# Altium project Oscar_MainBoard.PrjPCB
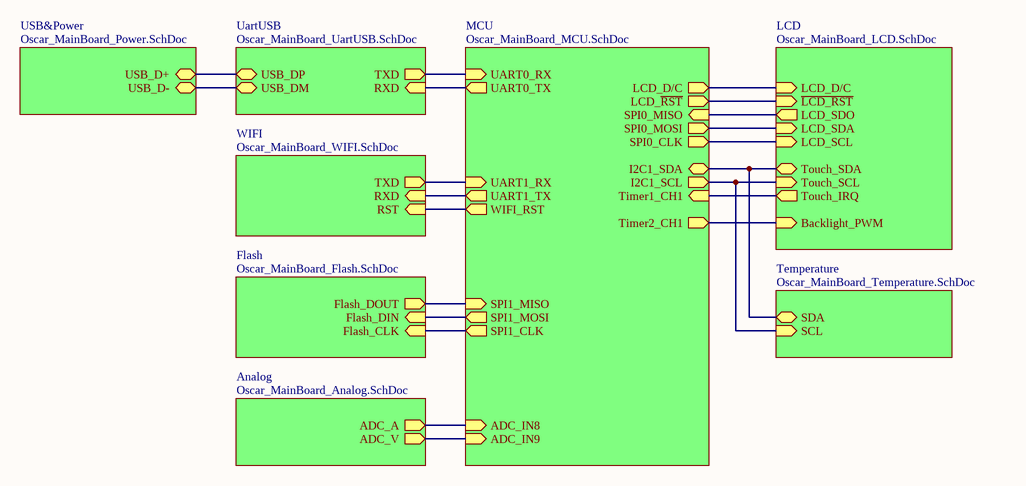
[diagram p0: Oscar_MainBoard_Root.SchDoc]
9 sheets, 103 parts. Net scope: hierarchical (ports join the sheet entries above them; power ports are global).
Board file: Oscar_MainBoard.PcbDoc
Sheets:
  Oscar_MainBoard_Root.SchDoc
    MCU = Oscar_MainBoard_MCU.SchDoc
    LCD = Oscar_MainBoard_LCD.SchDoc
    USB&Power = Oscar_MainBoard_Power.SchDoc
    UartUSB = Oscar_MainBoard_UartUSB.SchDoc
    WIFI = Oscar_MainBoard_WIFI.SchDoc
    Flash = Oscar_MainBoard_Flash.SchDoc
    Temperature = Oscar_MainBoard_Temperature.SchDoc
    Analog = Oscar_MainBoard_Analog.SchDoc

## Sheet Oscar_MainBoard_Root.SchDoc
size A4

### Sub-sheets
Analog = Oscar_MainBoard_Analog.SchDoc: ADC_A (out), ADC_V (out)
Flash = Oscar_MainBoard_Flash.SchDoc: Flash_CLK (in), Flash_DIN (in), Flash_DOUT (out)
LCD = Oscar_MainBoard_LCD.SchDoc: Touch_SCL (in), LCD_SDA (in), LCD_SDO (out), LCD_D/C (in), Backlight_PWM (in), LCD_SCL (in), Touch_SDA (bidir), Touch_IRQ (out), ~{LCD_RST} (in)
MCU = Oscar_MainBoard_MCU.SchDoc: UART1_RX (in), UART1_TX (out), SPI0_MISO (in), SPI0_CLK (out), UART0_RX (in), SPI1_CLK (out), SPI1_MOSI (out), SPI0_MOSI (out), UART0_TX (out), SPI1_MISO (in), I2C1_SDA (bidir), I2C1_SCL (out), LCD_D/C (out), LCD_~{RST} (out), Timer2_CH1 (out), Timer1_CH1 (in), WIFI_RST (out), ADC_IN8 (in), ADC_IN9 (in)
Temperature = Oscar_MainBoard_Temperature.SchDoc: SCL (in), SDA (bidir)
UartUSB = Oscar_MainBoard_UartUSB.SchDoc: USB_DM, USB_DP, RXD (in), TXD (out)
USB&Power = Oscar_MainBoard_Power.SchDoc: USB_D+, USB_D-
WIFI = Oscar_MainBoard_WIFI.SchDoc: TXD (out), RXD (in), RST (in)

### Nets
I2C1_SCL: sheet MCU/I2C1_SCL, sheet LCD/Touch_SCL, sheet Temperature/SCL
I2C1_SDA: sheet MCU/I2C1_SDA, sheet LCD/Touch_SDA, sheet Temperature/SDA
PA2: sheet MCU/UART1_TX, sheet WIFI/RXD
PA3: sheet MCU/UART1_RX, sheet WIFI/TXD
PA4: sheet MCU/LCD_~{RST}, sheet LCD/~{LCD_RST}
PA5: sheet MCU/SPI0_CLK, sheet LCD/LCD_SCL
PA6: sheet MCU/SPI0_MISO, sheet LCD/LCD_SDO
PA7: sheet MCU/SPI0_MOSI, sheet LCD/LCD_SDA
PA9: sheet MCU/UART0_TX, sheet UartUSB/RXD
PA10: sheet MCU/UART0_RX, sheet UartUSB/TXD
PA15: sheet MCU/WIFI_RST, sheet WIFI/RST
PB0: sheet MCU/ADC_IN8, sheet Analog/ADC_A
PB1: sheet MCU/ADC_IN9, sheet Analog/ADC_V
PB2: sheet MCU/LCD_D/C, sheet LCD/LCD_D/C
PB3: sheet MCU/Timer1_CH1, sheet LCD/Touch_IRQ
PB5: sheet MCU/Timer2_CH1, sheet LCD/Backlight_PWM
PB13: sheet MCU/SPI1_CLK, sheet Flash/Flash_CLK
PB14: sheet MCU/SPI1_MISO, sheet Flash/Flash_DOUT
PB15: sheet MCU/SPI1_MOSI, sheet Flash/Flash_DIN
NetU7_4: sheet USB&Power/USB_D+, sheet UartUSB/USB_DP
NetU7_5: sheet USB&Power/USB_D-, sheet UartUSB/USB_DM

## Sheet Oscar_MainBoard_MCU.SchDoc
size A4
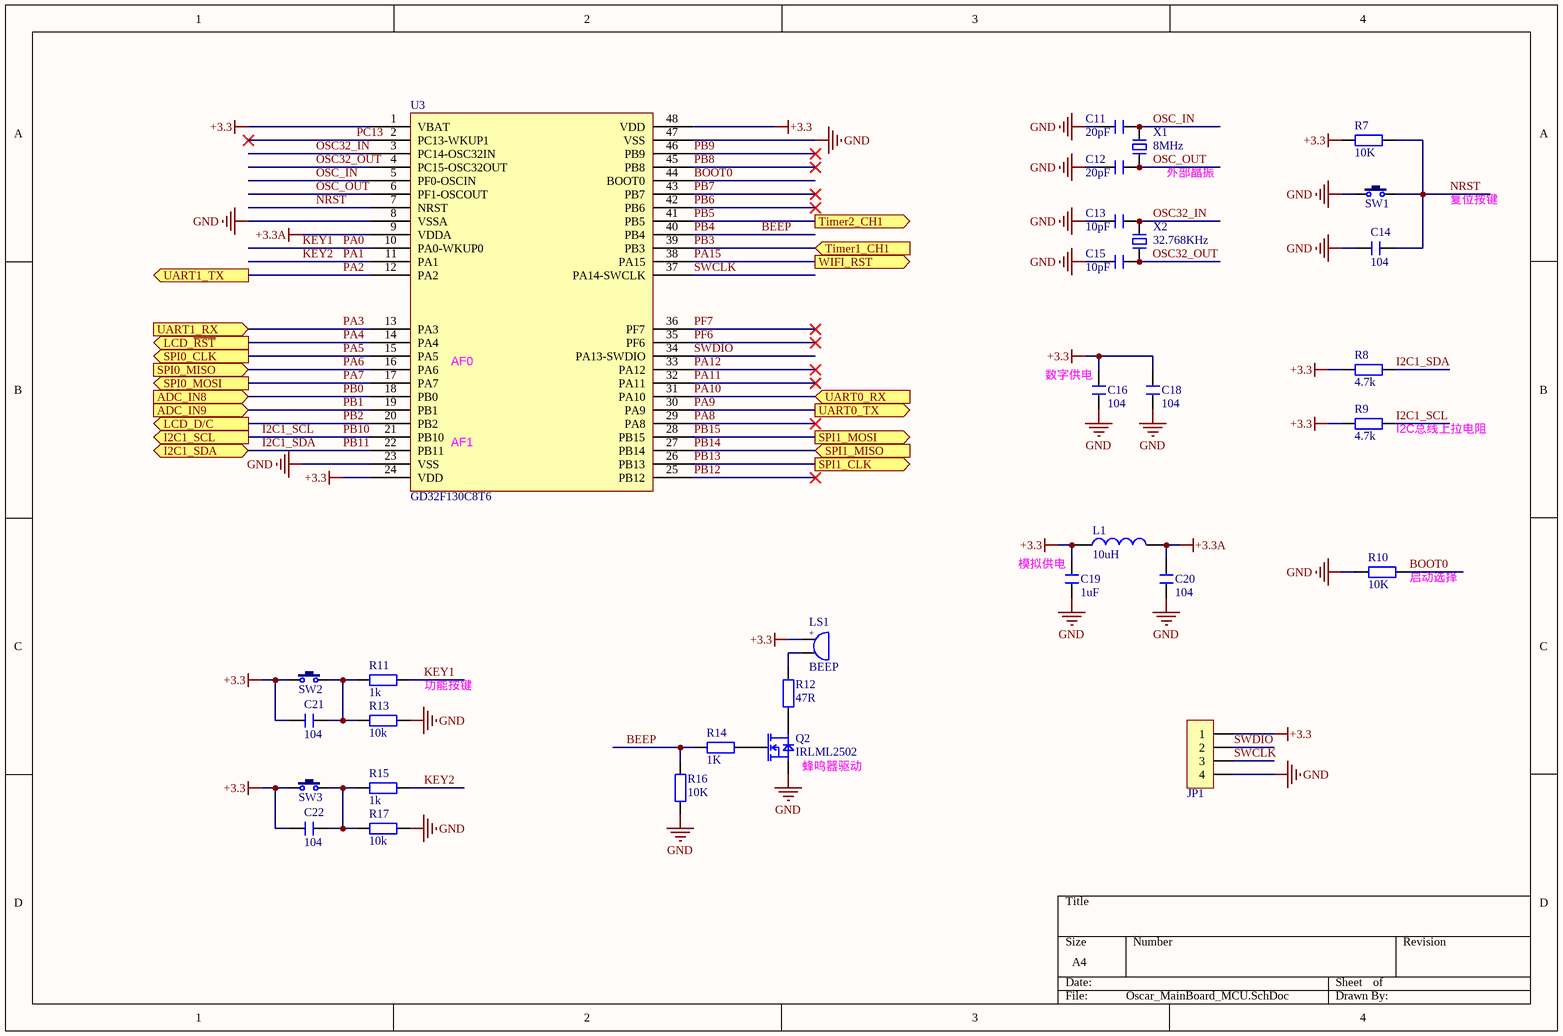
[diagram p1: Oscar_MainBoard_MCU.SchDoc]

### Parts
C11  20pF  [C 0402_L]
C12  20pF  [C 0402_L]
C13  10pF  [C 0402_L]
C14  104  [C 0402_L]
C15  10pF  [C 0402_L]
C16  104  [C 0402_L]
C18  104  [C 0402_L]
C19  1uF  [C 0402_L]
C20  104  [C 0402_L]
C21  104  [C 0402_L]
C22  104  [C 0402_L]
JP1  HDR-1X4  [HDR2.54-WS-4P]  (value not drawn)
L1  10uH  [L 0402]
LS1  BEEP  [BEEP 5020]
Q2  IRLML2502  [SOT23-3n]
R7  10K  [R 0402_L]
R8  4.7k  [R 0402_L]
R9  4.7k  [R 0402_L]
R10  10K  [R 0402_L]
R11  1k  [R 0402_L]
R12  47R  [R 0402_L]
R13  10k  [R 0402_L]
R14  1K  [R 0402_L]
R15  1k  [R 0402_L]
R16  10K  [R 0402_L]
R17  10k  [R 0402_L]
SW1  TSW  [龟仔 3*4]  (value not drawn)
SW2  TSW  [龟仔 3*4]  (value not drawn)
SW3  TSW  [龟仔 3*4]  (value not drawn)
U3  GD32F130C8T6  [LQFP48_N]
X1  8MHz  [NDK 3225]
X2  32.768KHz  [FC-135]

### Ports
ADC_IN8 (in), ADC_IN9 (in), I2C1_SCL (out), I2C1_SDA (bidir), LCD_D/C (out), LCD_~{RST} (out), SPI0_CLK (out), SPI0_MISO (in), SPI0_MOSI (out), SPI1_CLK (out), SPI1_MISO (in), SPI1_MOSI (out), Timer1_CH1 (in), Timer2_CH1 (out), UART0_RX (in), UART0_TX (out), UART1_RX (in), UART1_TX (out), WIFI_RST (out)

### Nets
+3.3: C16.2 C18.2 C19.2 C21.2 C22.2 JP1.1 L1.1 LS1.1 R7.2 R8.2 R9.2 SW2.1 SW3.1 U3.1(VBAT) U3.24(VDD) U3.48(VDD)
+3.3A: C20.2 L1.2 U3.9(VDDA)
GND: C11.1 C12.1 C13.1 C14.1 C15.1 C16.1 C18.1 C19.1 C20.1 JP1.4 Q2.2(S) R10.1 R13.1 R16.1 R17.1 SW1.1 U3.8(VSSA) U3.23(VSS) U3.47(VSS)
BEEP: R14.1 R16.2 U3.40(PB4)  [also labelled PB4]
BOOT0: R10.2 U3.44(BOOT0)
I2C1_SCL: R9.1 U3.21(PB10) ; port I2C1_SCL  [also labelled PB10]
I2C1_SDA: R8.1 U3.22(PB11) ; port I2C1_SDA  [also labelled PB11]
KEY1: R11.1 U3.10(PA0-WKUP0)  [also labelled PA0]
KEY2: R15.1 U3.11(PA1)  [also labelled PA1]
NRST: C14.2 R7.1 SW1.2 U3.7(NRST)
OSC32_IN: C13.2 U3.3(PC14-OSC32IN) X2.2
OSC32_OUT: C15.2 U3.4(PC15-OSC32OUT) X2.1
OSC_IN: C11.2 U3.5(PF0-OSCIN) X1.2
OSC_OUT: C12.2 U3.6(PF1-OSCOUT) X1.1
PA2: U3.12(PA2) ; port UART1_TX
PA3: U3.13(PA3) ; port UART1_RX
PA4: U3.14(PA4) ; port LCD_~{RST}
PA5: U3.15(PA5) ; port SPI0_CLK
PA6: U3.16(PA6) ; port SPI0_MISO
PA7: U3.17(PA7) ; port SPI0_MOSI
PA8: U3.29(PA8)
PA9: U3.30(PA9) ; port UART0_TX
PA10: U3.31(PA10) ; port UART0_RX
PA11: U3.32(PA11)
PA12: U3.33(PA12)
PA15: U3.38(PA15) ; port WIFI_RST
PB0: U3.18(PB0) ; port ADC_IN8
PB1: U3.19(PB1) ; port ADC_IN9
PB2: U3.20(PB2) ; port LCD_D/C
PB3: U3.39(PB3) ; port Timer1_CH1
PB5: U3.41(PB5) ; port Timer2_CH1
PB6: U3.42(PB6)
PB7: U3.43(PB7)
PB8: U3.45(PB8)
PB9: U3.46(PB9)
PB12: U3.25(PB12)
PB13: U3.26(PB13) ; port SPI1_CLK
PB14: U3.27(PB14) ; port SPI1_MISO
PB15: U3.28(PB15) ; port SPI1_MOSI
PC13: U3.2(PC13-WKUP1)
PF6: U3.35(PF6)
PF7: U3.36(PF7)
SWCLK: JP1.3 U3.37(PA14-SWCLK)
SWDIO: JP1.2 U3.34(PA13-SWDIO)
NetC21_1: C21.1 R11.2 R13.2 SW2.2
NetC22_1: C22.1 R15.2 R17.2 SW3.2
NetLS1_2: LS1.2 R12.2
NetQ2_1: Q2.1(G) R14.2
NetQ2_3: Q2.3(D) R12.1

### Notes on the sheet
- 外部晶振
- 复位按键
- (near U3) AF0
- (near C16) 数字供电
- (near U3) AF1
- (near R9) I2C总线上拉电阻
- (near C19) 模拟供电
- (near R10) 启动选择
- 功能按键
- (near Q2) 蜂鸣器驱动
- (in symbol BEEP) +

### Library data of the parts
C11-C16 C18-C22 = C: 贴片电容; BOM名称: 无极性贴片电容; 优秀评价可免费更新: 联系淘宝ID：黄晶宝石，获取更新版封装库; 卖家免费技术支持，联系售后: 唯一出售店铺网址https://shop463601444.taobao.com; 本封装库来自淘宝卖家 ID：黄晶宝石: 其他店铺购入均为盗版，请立即申请退款
JP1 = Header 4: 4P接插件; 版权归属: 封装库来自淘宝 ID：黄晶宝石; 优秀评价可免费更新: 联系淘宝ID：黄晶宝石，获取更新版封装库; 卖家免费技术支持，联系售后: 唯一出售店铺网址https://shop463601444.taobao.com; BOM名称: 4P接插件
L1 = L: 小功率贴片电感; 优秀评价可免费更新: 联系淘宝ID：黄晶宝石，获取更新版封装库; 卖家免费技术支持，联系售后: 唯一出售店铺网址https://shop463601444.taobao.com; 本封装库来自淘宝卖家 ID：黄晶宝石: 其他店铺购入均为盗版，请立即申请退款; BOM名称: 小功率贴片电感
LS1 = BEEP: 蜂鸣器; 优秀评价可免费更新: 联系淘宝ID：黄晶宝石，获取更新版封装库; 卖家免费技术支持，联系售后: 唯一出售店铺网址https://shop463601444.taobao.com; 封装库来自淘宝卖家 ID：黄晶宝石: 其他店铺购入均为盗版，请立即申请退款，本店提供现金奖励; BOM名称: 蜂鸣器
Q2 = IRLML2502: MOSFET N沟道 20V/4.2A
R7-R17 = R: 贴片电阻; 优秀评价可免费更新: 联系淘宝ID：黄晶宝石，获取更新版封装库; 卖家免费技术支持，联系售后: 唯一出售店铺网址https://shop463601444.taobao.com; 本封装库来自淘宝卖家 ID：黄晶宝石: 其他店铺购入均为盗版，请立即申请退款; BOM名称: 贴片电阻
SW1-SW3 = TSW: 轻触开关; BOM名称: 3x6轻触开关; 版权归属: 封装库来自淘宝 ID：黄晶宝石; 优秀评价可免费更新: 联系淘宝ID：黄晶宝石，获取更新版封装库; 卖家免费技术支持，联系售后: 唯一出售店铺网址https://shop463601444.taobao.com; 本封装库来自淘宝卖家 ID：黄晶宝石: 其他店铺购入均为盗版，请立即申请退款
U3 = GD32F130C8T6: 64K 8K 48MHz
X1 X2 = XTAL-2P: 2脚无源脚晶振; 版权归属: 封装库来自淘宝卖家 ID：黄晶宝石; 优秀评价可免费更新: 联系淘宝ID：黄晶宝石，获取更新版封装库; 卖家免费技术支持，联系售后: 唯一出售店铺网址https://shop463601444.taobao.com; 封装库来自淘宝卖家 ID：黄晶宝石: 其他店铺购入均为盗版，请立即申请退款; BOM名称: 2脚无源脚晶振

## Sheet Oscar_MainBoard_LCD.SchDoc
size A4
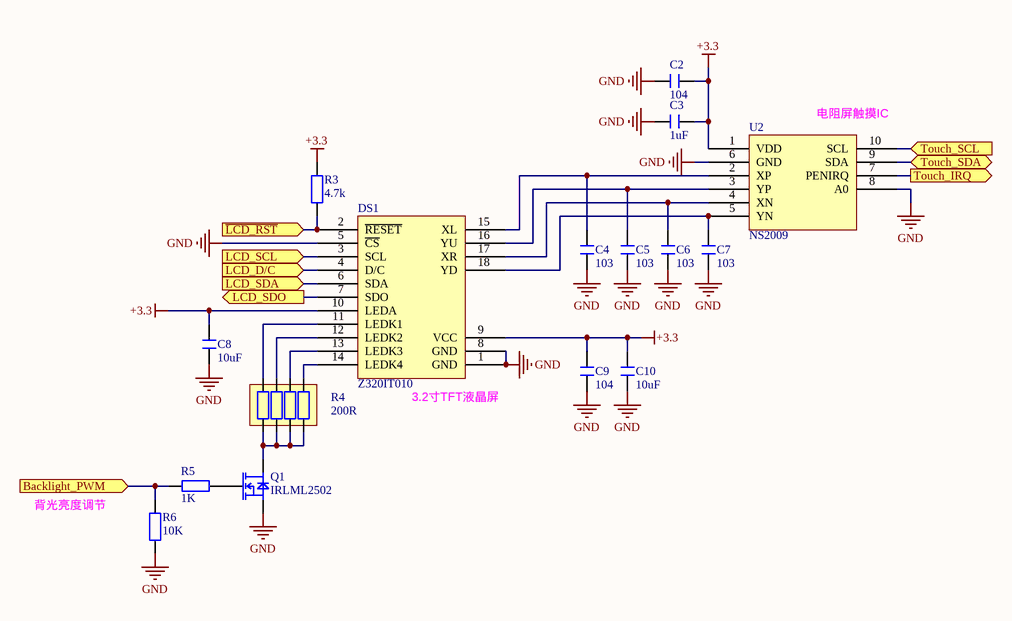
[diagram p2: Oscar_MainBoard_LCD.SchDoc]

### Parts
C2  104  [C 0402_L]
C3  1uF  [C 0402_L]
C4  103  [C 0402_L]
C5  103  [C 0402_L]
C6  103  [C 0402_L]
C7  103  [C 0402_L]
C8  10uF  [C 0603_L]
C9  104  [C 0402_L]
C10  10uF  [C 0603_L]
DS1  Z320IT010  [Z320IT010]
Q1  IRLML2502  [SOT23-3n]
R3  4.7k  [R 0402_L]
R4  200R  [RCA-8P4R-0402]
R5  1K  [R 0402_L]
R6  10K  [R 0402_L]
U2  NS2009  [MSOP10_N]

### Ports
Backlight_PWM (in), LCD_D/C (in), LCD_SCL (in), LCD_SDA (in), LCD_SDO (out), Touch_IRQ (out), Touch_SCL (in), Touch_SDA (bidir), ~{LCD_RST} (in)

### Nets
+3.3: C2.1 C3.1 C8.1 C9.1 C10.1 DS1.9(VCC) DS1.10(LEDA) R3.2 U2.1(VDD)
GND: C2.2 C3.2 C4.2 C5.2 C6.2 C7.2 C8.2 C9.2 C10.2 DS1.1(GND) DS1.5(~{CS}) DS1.8(GND) Q1.2(S) R6.1 U2.6(GND) U2.8(A0)
I2C1_SCL: U2.10(SCL) ; port Touch_SCL
I2C1_SDA: U2.9(SDA) ; port Touch_SDA
PA4: DS1.2(~{RESET}) R3.1 ; port ~{LCD_RST}
PA5: DS1.3(SCL) ; port LCD_SCL
PA6: DS1.7(SDO) ; port LCD_SDO
PA7: DS1.6(SDA) ; port LCD_SDA
PB2: DS1.4(D/C) ; port LCD_D/C
PB3: U2.7(PENIRQ) ; port Touch_IRQ
PB5: R5.1 R6.2 ; port Backlight_PWM
NetC4_1: C4.1 DS1.15(XL) U2.2(XP)
NetC5_1: C5.1 DS1.16(YU) U2.3(YP)
NetC6_1: C6.1 DS1.17(XR) U2.4(XN)
NetC7_1: C7.1 DS1.18(YD) U2.5(YN)
NetDS1_11: DS1.11(LEDK1) R4.8
NetDS1_12: DS1.12(LEDK2) R4.7
NetDS1_13: DS1.13(LEDK3) R4.6
NetDS1_14: DS1.14(LEDK4) R4.5
NetQ1_1: Q1.1(G) R5.2
NetQ1_3: Q1.3(D) R4.1 R4.2 R4.3 R4.4

### Notes on the sheet
- (near U2) 电阻屏触摸IC
- (near DS1) 3.2寸TFT液晶屏
- 背光亮度调节

### Library data of the parts
C2-C10 = C: as C11 on sheet Oscar_MainBoard_MCU
DS1 = Z320IT010: 3.2 inch TFT_LCD SPI
Q1 = IRLML2502: MOSFET N沟道 20V/4.2A
R3 R5 R6 = R: as R7 on sheet Oscar_MainBoard_MCU; BOM名称: 贴片电阻
R4 = R-8P4R: 贴片排阻; BOM名称: 贴片网络排阻; 优秀评价可免费更新: 联系淘宝ID：黄晶宝石，获取更新版封装库; 卖家免费技术支持，联系售后: 唯一出售店铺网址https://shop463601444.taobao.com; 本封装库来自淘宝卖家 ID：黄晶宝石: 其他店铺购入均为盗版，请立即申请退款
U2 = NS2009: I2C接口的4线制电阻式触摸屏控制电路

## Sheet Oscar_MainBoard_Power.SchDoc
size A4
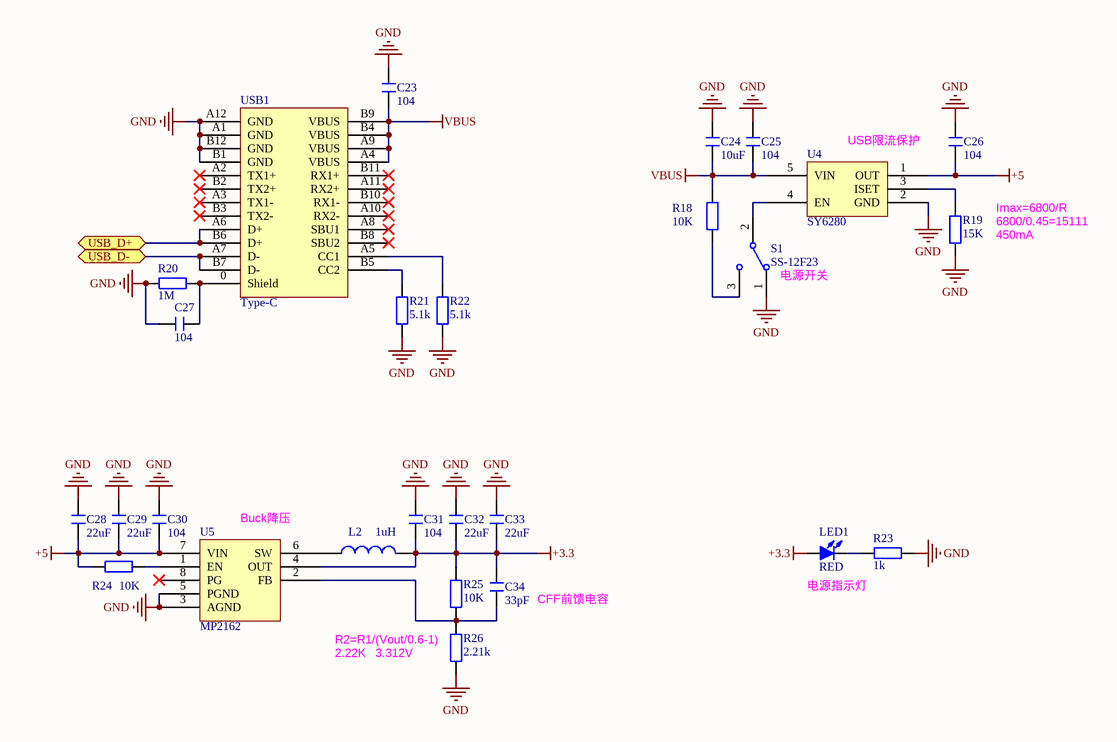
[diagram p3: Oscar_MainBoard_Power.SchDoc]

### Parts
C23  104  [C 0402_L]
C24  10uF  [C 0603_L]
C25  104  [C 0402_L]
C26  104  [C 0402_L]
C27  104  [C 0402_L]
C28  22uF  [C 0805_L]
C29  22uF  [C 0805_L]
C30  104  [C 0402_L]
C31  104  [C 0402_L]
C32  22uF  [C 0805_L]
C33  22uF  [C 0805_L]
C34  33pF  [C 0402_L]
L2  1uH  [CD32]
LED1  RED  [LED_0603]
R18  10K  [R 0402_L]
R19  15K  [R 0402_L]
R20  1M  [R 0402_L]
R21  5.1k  [R 0402_L]
R22  5.1k  [R 0402_L]
R23  1k  [R 0402_L]
R24  10K  [R 0402_L]
R25  10K  [R 0402_L]
R26  2.21k  [R 0402_L]
S1  SS-12F23  [MSK-12C01-07]
U4  SY6280  [SOT23-5N]
U5  MP2162  [QFN8]
USB1  Type-C  [USB-TYPE-C_16PIN-MALE-TYPE-C-31-M-12]

### Ports
USB_D+, USB_D-

### Nets
+3.3: C31.1 C32.1 C33.1 C34.2 L2.2 LED1.1(A) R25.1 U5.4(OUT)
+5: C26.1 C28.1 C29.1 C30.1 R24.1 U4.1(OUT) U5.7(VIN)
GND: C23.2 C24.2 C25.2 C26.2 C27.2 C28.2 C29.2 C30.2 C31.2 C32.2 C33.2 R19.2 R20.2 R21.1 R22.1 R23.2 R26.2 S1.1 U4.2(GND) U5.3(AGND) U5.5(PGND) USB1.A1(GND) USB1.A12(GND) USB1.B1(GND) USB1.B12(GND)
VBUS: C23.1 C24.1 C25.1 R18.1 U4.5(VIN) USB1.A4(VBUS) USB1.A9(VBUS) USB1.B4(VBUS) USB1.B9(VBUS)
NetC27_1: C27.1 R20.1 USB1.0(Shield)
NetC34_1: C34.1 R25.2 R26.1 U5.2(FB)
NetL2_1: L2.1 U5.6(SW)
NetLED1_2: LED1.2(K) R23.1
NetR18_2: R18.2 S1.3
NetR19_1: R19.1 U4.3(ISET)
NetR21_2: R21.2 USB1.B5(CC2)
NetR22_2: R22.2 USB1.A5(CC1)
NetR24_2: R24.2 U5.1(EN)
NetS1_2: S1.2 U4.4(EN)
NetU7_4: USB1.A6(D+) USB1.B6(D+) ; port USB_D+
NetU7_5: USB1.A7(D-) USB1.B7(D-) ; port USB_D-

Not connected (* = marked no-connect by the designer): U5 8(PG)*; USB1 A2(TX1+)* A3(TX1-)* A8(SBU1)* A10(RX2-)* A11(RX2+)* B2(TX2+)* B3(TX2-)* B8(SBU2)* B10(RX1-)* B11(RX1+)*

### Notes on the sheet
- (near U4) USB限流保护
- (near R19) Imax=6800/R
- (near R19) 6800/0.45=15111
- (near R19) 450mA
- (near S1) 电源开关
- (near U5) Buck降压
- (near R26) R2=R1/(Vout/0.6-1)
- (near C34) CFF前馈电容
- (near LED1) 电源指示灯
- 2.22K
- 3.312V

### Library data of the parts
C23-C34 = C: as C11 on sheet Oscar_MainBoard_MCU
L2 = L: as L1 on sheet Oscar_MainBoard_MCU; BOM名称: 小功率贴片电感
LED1 = LED-SMD: 贴片LED; 优秀评价可免费更新: 联系淘宝ID：黄晶宝石，获取更新版封装库; 卖家免费技术支持，联系售后: 唯一出售店铺网址https://shop463601444.taobao.com; 封装库来自淘宝卖家 ID：黄晶宝石: 其他店铺购入均为假冒，请立即申请退款，本店奖励2~5元现金; BOM名称: 贴片LED
R18-R26 = R: as R7 on sheet Oscar_MainBoard_MCU; BOM名称: 贴片电阻
S1 = SSW-1P: 1路波动开关; BOM名称: 波动开关; 版权归属: 封装库来自淘宝 ID：黄晶宝石; 优秀评价可免费更新: 联系淘宝ID：黄晶宝石，获取更新版封装库; 卖家免费技术支持，联系售后: 唯一出售店铺网址https://shop463601444.taobao.com; 本封装库来自淘宝卖家 ID：黄晶宝石: 其他店铺购入均为盗版，请立即申请退款
U4 = SY6280: 电源限流保护芯片
U5 = MP2162: 2.5-6v 2A buck IC

## Sheet Oscar_MainBoard_UartUSB.SchDoc
size A4
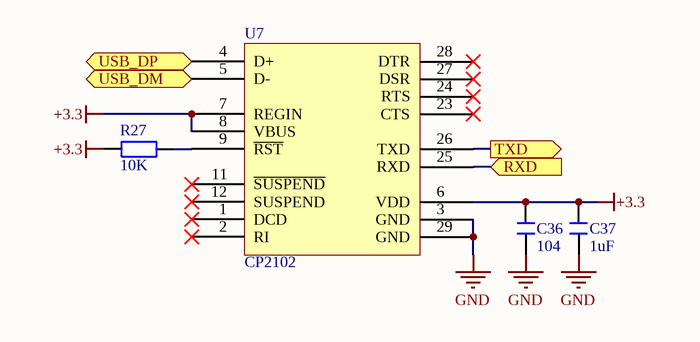
[diagram p4: Oscar_MainBoard_UartUSB.SchDoc]

### Parts
C36  104  [C 0402_L]
C37  1uF  [C 0402_L]
R27  10K  [R 0402_L]
U7  CP2102  [QFN28 5x5_N]

### Ports
RXD (in), TXD (out), USB_DM, USB_DP

### Nets
+3.3: C36.2 C37.2 R27.1 U7.6(VDD) U7.7(REGIN) U7.8(VBUS)
GND: C36.1 C37.1 U7.3(GND) U7.29(GND)
PA9: U7.25(RXD) ; port RXD
PA10: U7.26(TXD) ; port TXD
NetR27_2: R27.2 U7.9(~{RST})
NetU7_4: U7.4(D+) ; port USB_DP
NetU7_5: U7.5(D-) ; port USB_DM

Not connected (* = marked no-connect by the designer): U7 1(DCD)* 2(RI)* 11(~{SUSPEND})* 12(SUSPEND)* 23(CTS)* 24(RTS)* 27(DSR)* 28(DTR)*

### Library data of the parts
C36 C37 = C: as C11 on sheet Oscar_MainBoard_MCU
R27 = R: as R7 on sheet Oscar_MainBoard_MCU; BOM名称: 贴片电阻
U7 = CP2102: CP2102 uart usb

## Sheet Oscar_MainBoard_WIFI.SchDoc
size A4
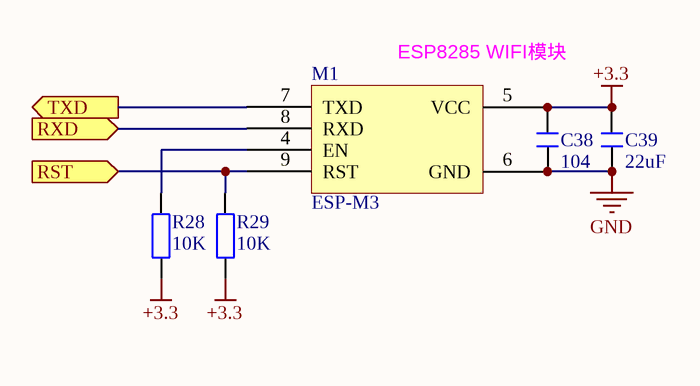
[diagram p5: Oscar_MainBoard_WIFI.SchDoc]

### Parts
C38  104  [C 0402_L]
C39  22uF  [C 0805_L]
M1  ESP-M3  [ESP-M3]
R28  10K  [R 0402_L]
R29  10K  [R 0402_L]

### Ports
RST (in), RXD (in), TXD (out)

### Nets
+3.3: C38.2 C39.2 M1.5(VCC) R28.1 R29.1
GND: C38.1 C39.1 M1.6(GND)
PA2: M1.8(RXD) ; port RXD
PA3: M1.7(TXD) ; port TXD
PA15: M1.9(RST) R29.2 ; port RST
NetM1_4: M1.4(EN) R28.2

### Notes on the sheet
- ESP8285 WIFI模块

### Library data of the parts
C38 C39 = C: as C11 on sheet Oscar_MainBoard_MCU
M1 = ESP-M3: 四博智联ESP-M3无线模块
R28 R29 = R: as R7 on sheet Oscar_MainBoard_MCU; BOM名称: 贴片电阻

## Sheet Oscar_MainBoard_Flash.SchDoc
size A4
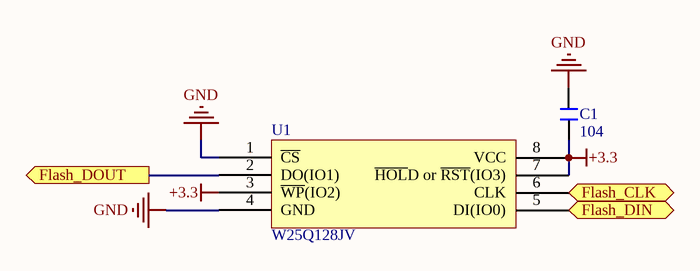
[diagram p6: Oscar_MainBoard_Flash.SchDoc]

### Parts
C1  104  [C 0402_L]
U1  W25Q128JV  [WSON-8_5X6MM]

### Ports
Flash_CLK (in), Flash_DIN (in), Flash_DOUT (out)

### Nets
+3.3: C1.1 U1.3(~{WP}(IO2)) U1.7(~{HOL}D_or_~{RST}(IO3)) U1.8(VCC)
GND: C1.2 U1.1(~{CS}) U1.4(GND)
PB13: U1.6(CLK) ; port Flash_CLK
PB14: U1.2(DO(IO1)) ; port Flash_DOUT
PB15: U1.5(DI(IO0)) ; port Flash_DIN

### Library data of the parts
C1 = C: as C11 on sheet Oscar_MainBoard_MCU
U1 = W25Q128JV: 128Mbit

## Sheet Oscar_MainBoard_Temperature.SchDoc
size A4
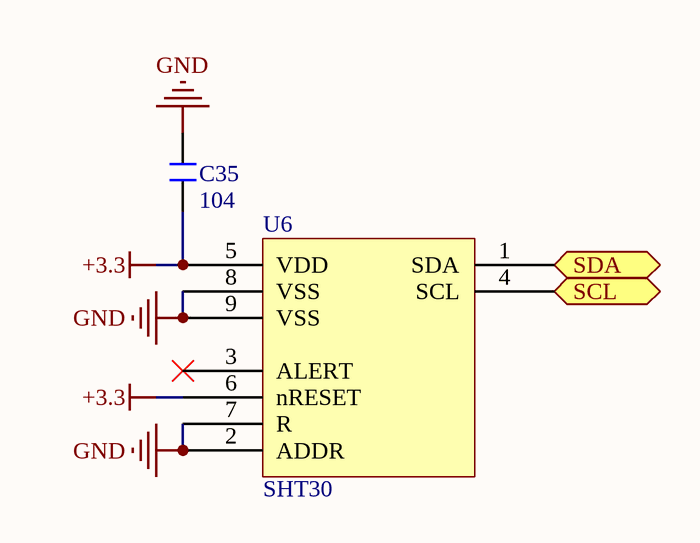
[diagram p7: Oscar_MainBoard_Temperature.SchDoc]

### Parts
C35  104  [C 0402_L]
U6  SHT30  [DFN-8_L2.5-W2.5-P0.50-BL-EP]

### Ports
SCL (in), SDA (bidir)

### Nets
+3.3: C35.1 U6.5(VDD) U6.6(nRESET)
GND: C35.2 U6.2(ADDR) U6.7(R) U6.8(VSS) U6.9(VSS)
I2C1_SCL: U6.4(SCL) ; port SCL
I2C1_SDA: U6.1(SDA) ; port SDA

Not connected (* = marked no-connect by the designer): U6 3(ALERT)*

### Library data of the parts
C35 = C: as C11 on sheet Oscar_MainBoard_MCU

## Sheet Oscar_MainBoard_Analog.SchDoc
size A4
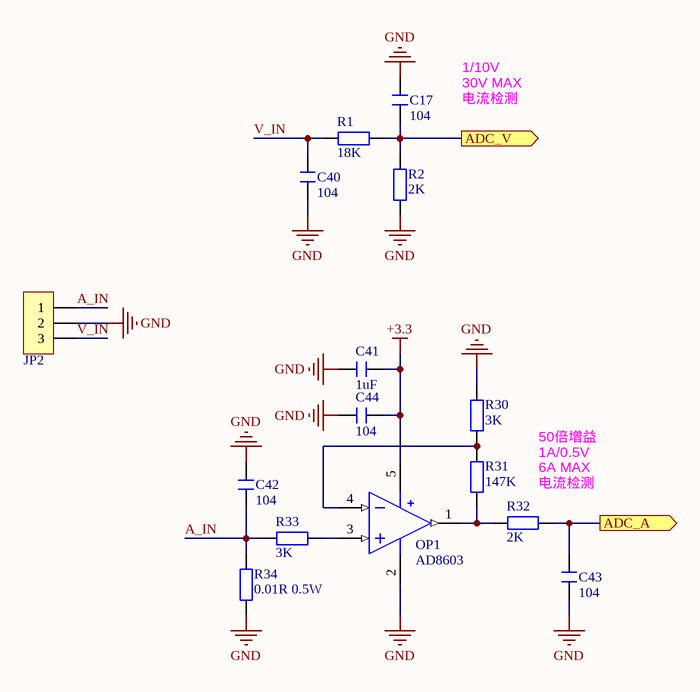
[diagram p8: Oscar_MainBoard_Analog.SchDoc]

### Parts
C17  104  [C 0402_L]
C40  104  [C 0402_L]
C41  1uF  [C 0402_L]
C42  104  [C 0402_L]
C43  104  [C 0402_L]
C44  104  [C 0402_L]
JP2  HDR-1X3  [MX 1.25-WS-3P]  (value not drawn)
OP1  AD8603  [SOT23-5N]
R1  18K  [R 0402_L]
R2  2K  [R 0402_L]
R30  3K  [R 0402_L]
R31  147K  [R 0402_L]
R32  2K  [R 0402_L]
R33  3K  [R 0402_L]
R34  0.01R 0.5W  [R 0805_L]

### Ports
ADC_A (out), ADC_V (out)

### Nets
+3.3: C41.1 C44.1 OP1.5(VCC)
GND: C17.1 C40.2 C41.2 C42.1 C43.2 C44.2 JP2.2 OP1.2(VEE) R2.2 R30.2 R34.2
A_IN: C42.2 JP2.1 R33.1 R34.1
PB0: C43.1 R32.1 ; port ADC_A
PB1: C17.2 R1.2 R2.1 ; port ADC_V
V_IN: C40.1 JP2.3 R1.1
NetOP1_1: OP1.1(OUT) R31.1 R32.2
NetOP1_3: OP1.3(IN+) R33.2
NetOP1_4: OP1.4(IN-) R30.1 R31.2

### Notes on the sheet
- 电流检测
- 1/10V
- 30V MAX
- 50倍增益
- (near R32) 电流检测
- 1A/0.5V
- 6A MAX

### Library data of the parts
C17 C40-C44 = C: as C11 on sheet Oscar_MainBoard_MCU
JP2 = Header 3: 3P接插件; 卖家免费技术支持，联系售后: 唯一出售店铺网址https://shop463601444.taobao.com; 封装库来自淘宝卖家 ID：黄晶宝石: 其他店铺购入均为假冒，请申请退款，本店现金奖励; 优秀评价可免费更新封装库: 联系淘宝ID：黄晶宝石，获取更新版封装库; BOM名称: 3P接插件
OP1 = AD8603: 精密低功耗轨对轨
R1 R2 R30-R34 = R: as R7 on sheet Oscar_MainBoard_MCU; BOM名称: 贴片电阻

## Nets that join several sheets
+3.3: Oscar_MainBoard_MCU (16 pins), Oscar_MainBoard_LCD (9 pins), Oscar_MainBoard_Power (8 pins), Oscar_MainBoard_UartUSB (6 pins), Oscar_MainBoard_WIFI (5 pins), Oscar_MainBoard_Flash (C1.1 U1.3 U1.7 U1.8), Oscar_MainBoard_Temperature (C35.1 U6.5 U6.6), Oscar_MainBoard_Analog (C41.1 C44.1 OP1.5)
GND: Oscar_MainBoard_MCU (19 pins), Oscar_MainBoard_LCD (16 pins), Oscar_MainBoard_Power (25 pins), Oscar_MainBoard_UartUSB (C36.1 C37.1 U7.3 U7.29), Oscar_MainBoard_WIFI (C38.1 C39.1 M1.6), Oscar_MainBoard_Flash (C1.2 U1.1 U1.4), Oscar_MainBoard_Temperature (5 pins), Oscar_MainBoard_Analog (11 pins)
I2C1_SCL: Oscar_MainBoard_MCU (R9.1 U3.21), Oscar_MainBoard_LCD (U2.10), Oscar_MainBoard_Temperature (U6.4)
I2C1_SDA: Oscar_MainBoard_MCU (R8.1 U3.22), Oscar_MainBoard_LCD (U2.9), Oscar_MainBoard_Temperature (U6.1)
NetU7_4: Oscar_MainBoard_Power (USB1.A6 USB1.B6), Oscar_MainBoard_UartUSB (U7.4)
NetU7_5: Oscar_MainBoard_Power (USB1.A7 USB1.B7), Oscar_MainBoard_UartUSB (U7.5)
PA2: Oscar_MainBoard_MCU (U3.12), Oscar_MainBoard_WIFI (M1.8)
PA3: Oscar_MainBoard_MCU (U3.13), Oscar_MainBoard_WIFI (M1.7)
PA4: Oscar_MainBoard_MCU (U3.14), Oscar_MainBoard_LCD (DS1.2 R3.1)
PA5: Oscar_MainBoard_MCU (U3.15), Oscar_MainBoard_LCD (DS1.3)
PA6: Oscar_MainBoard_MCU (U3.16), Oscar_MainBoard_LCD (DS1.7)
PA7: Oscar_MainBoard_MCU (U3.17), Oscar_MainBoard_LCD (DS1.6)
PA9: Oscar_MainBoard_MCU (U3.30), Oscar_MainBoard_UartUSB (U7.25)
PA10: Oscar_MainBoard_MCU (U3.31), Oscar_MainBoard_UartUSB (U7.26)
PA15: Oscar_MainBoard_MCU (U3.38), Oscar_MainBoard_WIFI (M1.9 R29.2)
PB0: Oscar_MainBoard_MCU (U3.18), Oscar_MainBoard_Analog (C43.1 R32.1)
PB1: Oscar_MainBoard_MCU (U3.19), Oscar_MainBoard_Analog (C17.2 R1.2 R2.1)
PB2: Oscar_MainBoard_MCU (U3.20), Oscar_MainBoard_LCD (DS1.4)
PB3: Oscar_MainBoard_MCU (U3.39), Oscar_MainBoard_LCD (U2.7)
PB5: Oscar_MainBoard_MCU (U3.41), Oscar_MainBoard_LCD (R5.1 R6.2)
PB13: Oscar_MainBoard_MCU (U3.26), Oscar_MainBoard_Flash (U1.6)
PB14: Oscar_MainBoard_MCU (U3.27), Oscar_MainBoard_Flash (U1.2)
PB15: Oscar_MainBoard_MCU (U3.28), Oscar_MainBoard_Flash (U1.5)